# EAGLE design IMU (EAGLE 5.07)
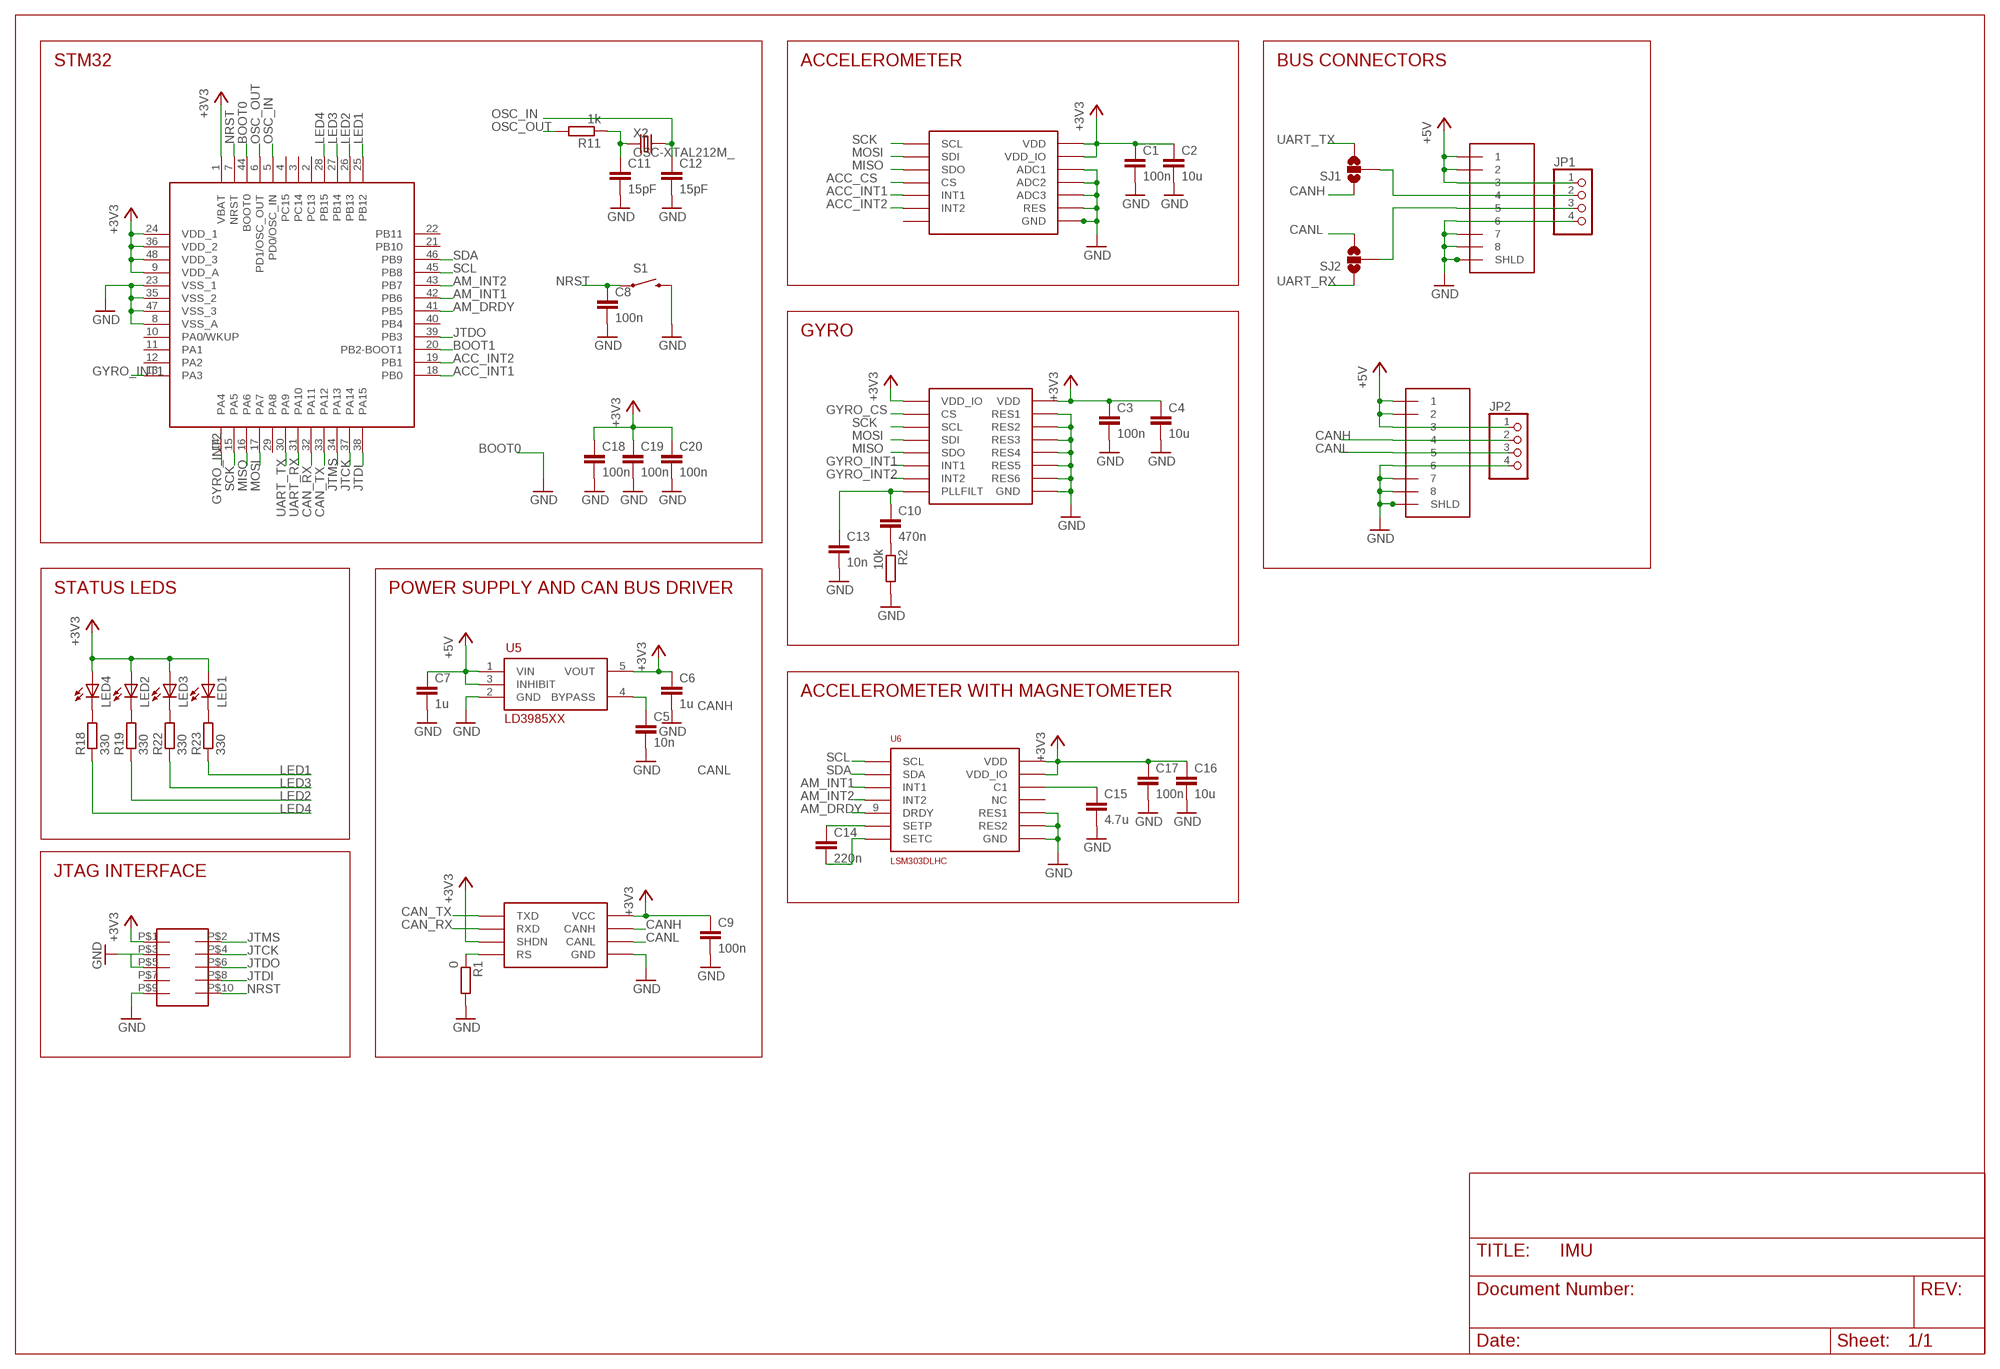
[diagram p0: schematic, sheet 1]

## Parts
1  RJ45-43860  [0438600010]
2  RJ45-43860  [0438600010]
C1  100n  C-EUC0603  [C0603]
C2  10u  C-EUC0805  [C0805]
C3  100n  C-EUC0603  [C0603]
C4  10u  C-EUC0805  [C0805]
C5  10n  C-EUC0603  [C0603]
C6  1u  C-EUC0603  [C0603]
C7  1u  C-EUC0603  [C0603]
C8  100n  C-EUC0603  [C0603]
C9  100n  C-EUC0603  [C0603]
C10  470n  C-EUC0603  [C0603]
C11  15pF  C-EUC0603  [C0603]
C12  15pF  C-EUC0603  [C0603]
C13  10n  C-EUC0603  [C0603]
C14  220n  C-EUC0603  [C0603]
C15  4.7u  C-EUC0805  [C0805]
C16  10u  C-EUC0805  [C0805]
C17  100n  C-EUC0603  [C0603]
C18  100n  C-EUC0603  [C0603]
C19  100n  C-EUC0603  [C0603]
C20  100n  C-EUC0603  [C0603]
JP1  PINHD-1X4/90  [1X04/90]
JP2  PINHD-1X4/90  [1X04/90]
LED1  LEDCHIPLED_0805  [CHIPLED_0805]
LED2  LEDCHIPLED_0805  [CHIPLED_0805]
LED3  LEDCHIPLED_0805  [CHIPLED_0805]
LED4  LEDCHIPLED_0805  [CHIPLED_0805]
R1  0  R-EU_R0603  [R0603]
R2  10k  R-EU_R0603  [R0603]
R11  1k  R-EU_R0603  [R0603]
R18  330  R-EU_R0603  [R0603]
R19  330  R-EU_R0603  [R0603]
R22  330  R-EU_R0603  [R0603]
R23  330  R-EU_R0603  [R0603]
S1  SWITCH-MOMENTARY-2-SMD-1101NE  [TACTILE-SWITCH-1101NE]
SJ1  SOLDERJUMPER_2WAYPASTE1&2  [SJ_3_PASTE1&2]
SJ2  SOLDERJUMPER_2WAYPASTE1&2  [SJ_3_PASTE1&2]
SOT1  MAX3051  [SOT23-8L]
U1  STM32F103CX  [LQFP48]
U2  L3G4200D  [LGA16]
U3  LIS3DH  [LGA16]
U5  LD3985XX  [SOT23-5L]
U6  LSM303DLHC  [LGA14]
U$4  FTSH-105  [FTSH-105]
X2  OSC-XTAL212M_  [4X6]

## Nets
+3V3: C1.1 C2.1 C3.1 C4.1 C6.1 C9.1 C16.1 C17.1 C18.1 C19.1 C20.1 LED1.A LED2.A LED3.A LED4.A SOT1.P$3(VCC) SOT1.P$5(SHDN) U1.1(VBAT) U1.9(VDD_A) U1.24(VDD_1) U1.36(VDD_2) U1.48(VDD_3) U2.P$1(VDD_IO) U2.P$16(VDD) U3.P$1(VDD_IO) U3.P$14(VDD) U5.5(VOUT) U6.1(VDD_IO) U6.14(VDD) U$4.P$1
+5V: 1.P$1 1.P$2 1.P$3 2.P$1 2.P$2 2.P$3 C7.1 JP1.1 JP2.1 U5.1(VIN) U5.3(INHIBIT)
ACC_CS: U3.P$8(CS)
ACC_INT1: U1.18(PB0) U3.P$11(INT1)
ACC_INT2: U1.19(PB1) U3.P$9(INT2)
AM_DRDY: U1.41(PB5) U6.9(DRDY)
AM_INT1: U1.42(PB6) U6.5(INT1)
AM_INT2: U1.43(PB7) U6.4(INT2)
BOOT0: U1.44(BOOT0) ; supply symbol labelled GND
BOOT1: U1.20(PB2-BOOT1)
CAN_RX: SOT1.P$4(RXD) U1.32(PA11)
CAN_TX: SOT1.P$1(TXD) U1.33(PA12)
CANH: 2.P$4 JP2.2 SJ1.1 SOT1.P$7(CANH)
CANL: 2.P$5 JP2.3 SJ2.3 SOT1.P$6(CANL)
GND: 1.P$6 1.P$7 1.P$8 1.P$9(SHLD) 1.P$10 2.P$6 2.P$7 2.P$8 2.P$9(SHLD) 2.P$10 C1.2 C2.2 C3.2 C4.2 C5.2 C6.2 C7.2 C8.2 C9.2 C11.2 C12.2 C13.2 C15.2 C16.2 C17.2 C18.2 C19.2 C20.2 JP1.4 JP2.4 R1.2 R2.2 S1.P$2 SOT1.P$2(GND) U1.8(VSS_A) U1.23(VSS_1) U1.35(VSS_2) U1.47(VSS_3) U2.P$8(RES1) U2.P$9(RES2) U2.P$10(RES3) U2.P$11(RES4) U2.P$12(RES5) U2.P$13(GND) U2.P$15(RES6) U3.P$5(GND) U3.P$10(RES) U3.P$12(GND_2) U3.P$13(ADC3) U3.P$15(ADC2) U3.P$16(ADC1) U5.2(GND) U6.7(GND) U6.10(RES1) U6.11(RES2) U$4.P$3 U$4.P$9
GYRO_CS: U2.P$5(CS)
GYRO_INT1: U1.13(PA3) U2.P$7(INT1)
GYRO_INT2: U1.14(PA4) U2.P$6(INT2)
JTCK: U1.37(PA14) U$4.P$4
JTDI: U1.38(PA15) U$4.P$8
JTDO: U1.39(PB3) U$4.P$6
JTMS: U1.34(PA13) U$4.P$2
LED1: R23.1 U1.25(PB12)
LED2: R19.1 U1.26(PB13)
LED3: R22.1 U1.27(PB14)
LED4: R18.1 U1.28(PB15)
MISO: U1.16(PA6) U2.P$4(SDO) U3.P$7(SDO)
MOSI: U1.17(PA7) U2.P$3(SDI) U3.P$6(SDI)
N$1: U$4.P$5
N$2: R1.1 SOT1.P$8(RS)
N$3: 1.P$4 JP1.2 SJ1.2
N$4: C5.1 U5.4(BYPASS)
N$8: 1.P$5 JP1.3 SJ2.2
N$9: C10.2 R2.1
N$10: C10.1 C13.1 U2.P$14(PLLFILT)
N$12: C11.1 R11.1 X2.1(X1)
N$14: C14.1 U6.12(SETP)
N$15: LED4.C R18.2
N$16: C14.2 U6.13(SETC)
N$17: C15.1 U6.6(C1)
N$18: LED2.C R19.2
N$20: LED3.C R22.2
N$22: LED1.C R23.2
NRST: C8.1 S1.P$1 U1.7(NRST) U$4.P$10
OSC_IN: C12.1 U1.5(PD0/OSC_IN) X2.2(X2)
OSC_OUT: R11.2 U1.6(PD1/OSC_OUT)
SCK: U1.15(PA5) U2.P$2(SCL) U3.P$4(SCL)
SCL: U1.45(PB8) U6.2(SCL)
SDA: U1.46(PB9) U6.3(SDA)
UART_RX: SJ2.1 U1.31(PA10)
UART_TX: SJ1.3 U1.30(PA9)
Unconnected: U1.2(PC13) U1.3(PC14) U1.4(PC15) U1.10(PA0/WKUP) U1.11(PA1) U1.12(PA2) U1.21(PB10) U1.22(PB11) U1.29(PA8) U1.40(PB4) U3.P$2(NC1) U3.P$3(NC2) U6.8(NC) U$4.P$7

## Notes on the sheet
- STM32 | ACCELEROMETER | BUS CONNECTORS
- GYRO
- STATUS LEDS | POWER SUPPLY AND CAN BUS DRIVER
- ACCELEROMETER WITH MAGNETOMETER
- JTAG INTERFACE

## Library data of the parts
1 2 = molex:RJ45-43860
C1-C20 = rcl:C-EU: CAPACITOR, European symbol
JP1 JP2 = pinhead:PINHD-1X4: PIN HEADER
LED1-LED4 = led:LED: LED OSRAM: - CHIPLED LG R971, LG N971, LY N971, LG Q971, LY Q971, LO R971, LY R971 LH N974, LH R974 LS Q976, LO Q976, LY Q976 LO Q996 - Hyper CHIPLED LW Q18S LB Q993, LB Q99A, LB R99A - SideLED LS A670, LO A670, LY A670, LG A670, LP A670 LB A673, LV A673, LT A673, LW A673 LH A674 LY A675 LS A676, LA A676, LO A676, LY A676, LW A676 LS A679, LY A679, LG A679 - Hyper Micro SIDELED® LS Y876, LA Y876, LO Y876, LY Y876 LT Y87S - SmartLED LW L88C, LW L88S LB L89C, LB L89S, LG L890 LS L89K, LO L89K, LY L89K LS L896, LA L896, LO L896, LY L896 - TOPLED LS T670, LO T670, LY T670, LG T670, LP T670 LSG T670, LSP T670, LSY T670, LOP T670, LYG T670 LG T671, LOG T671, LSG T671 LB T673, LV T673, LT T673, LW T673 LH T674 LS T676, LA T676, LO T676, LY T676, LB T676, LH T676, LSB T676, LW T676 LB T67C, LV T67C, LT T67C, LS T67K, LO T67K, LY T67K, LW E67C LS E67B, LA E67B, LO E67B, LY E67B, LB E67C, LV E67C, LT E67C LW T67C LS T679, LY T679, LG T679 LS T770, LO T770, LY T770, LG T770, LP T770 LB T773, LV T773, LT T773, LW T773 LH T774 LS E675, LA E675, LY E675, LS T675 LS T776, LA T776, LO T776, LY T776, LB T776 LHGB T686 LT T68C, LB T68C - Hyper Mini TOPLED® LB M676 - Mini TOPLED Santana® LG M470 LS M47K, LO M47K, LY M47K Source: http://www.osram.convergy.de LUXEON: - LUMILED® LXK2-PW12-R00, LXK2-PW12-S00, LXK2-PW14-U00, LXK2-PW14-V00 LXK2-PM12-R00, LXK2-PM12-S00, LXK2-PM14-U00 LXK2-PE12-Q00, LXK2-PE12-R00, LXK2-PE12-S00, LXK2-PE14-T00, LXK2-PE14-U00 LXK2-PB12-K00, LXK2-PB12-L00, LXK2-PB12-M00, LXK2-PB14-N00, LXK2-PB14-P00, LXK2-PB14-Q00 LXK2-PR12-L00, LXK2-PR12-M00, LXK2-PR14-Q00, LXK2-PR14-R00 LXK2-PD12-Q00, LXK2-PD12-R00, LXK2-PD12-S00 LXK2-PH12-R00, LXK2-PH12-S00 LXK2-PL12-P00, LXK2-PL12-Q00, LXK2-PL12-R00 Source: www.luxeon.com KINGBRIGHT: KA-3528ASYC Source: www.kingbright.com
R1 R2 R11 R18 R19 R22 R23 = rcl:R-EU_: RESISTOR, European symbol
S1 = SparkFun:SWITCH-MOMENTARY-2
SJ1 SJ2 = SparkFun:SOLDERJUMPER_2WAY: Solder Jumper 2 way solder jumper
SOT1 = maxim:MAX3051
U1 = st:STM32F103CX
U2 = st:L3G4200D
U3 = st:LIS3DH
U5 = st:LD3985XX
U6 = st:LSM303DLHC
U$4 = samtec:FTSH-105
X2 = dp_devices:OSC-XTAL2

## Board
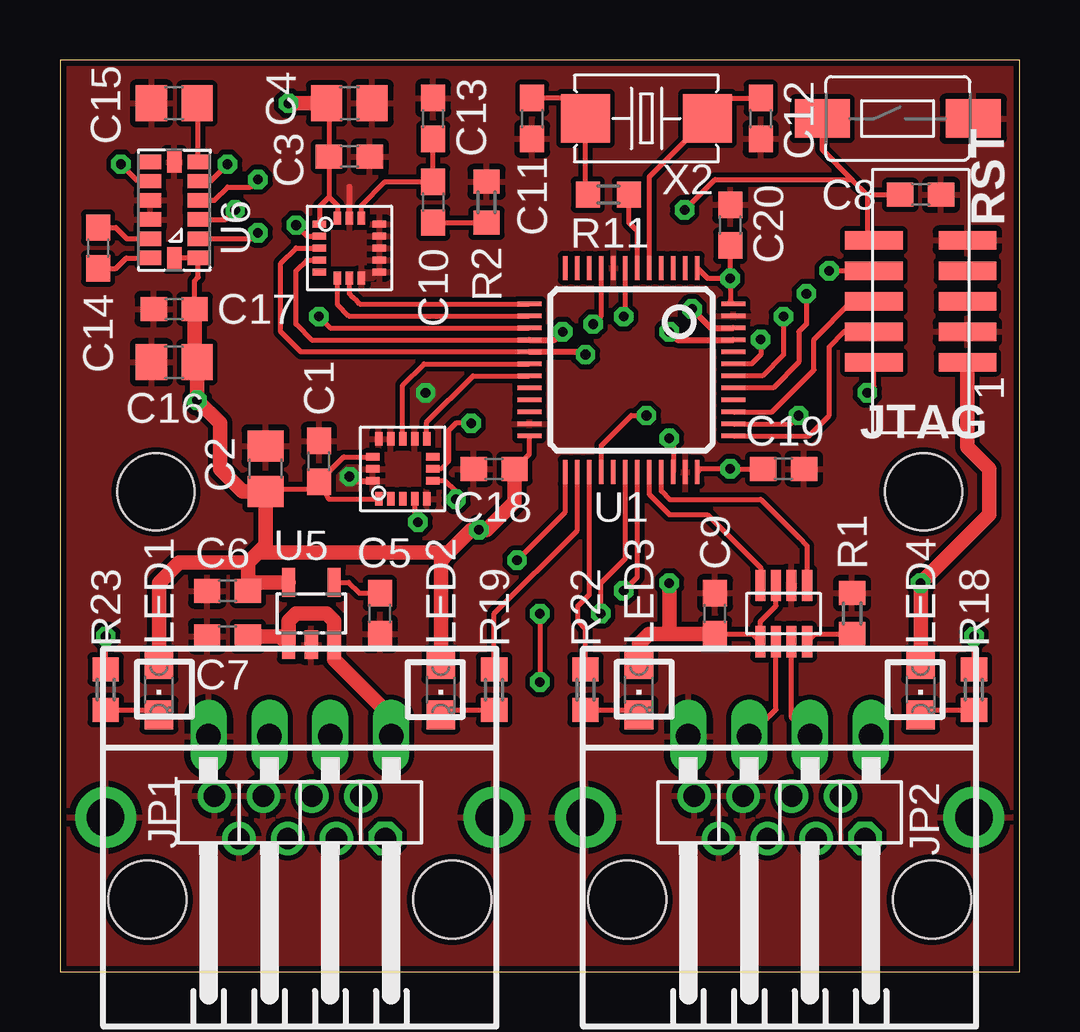
[diagram p1: board, top side]
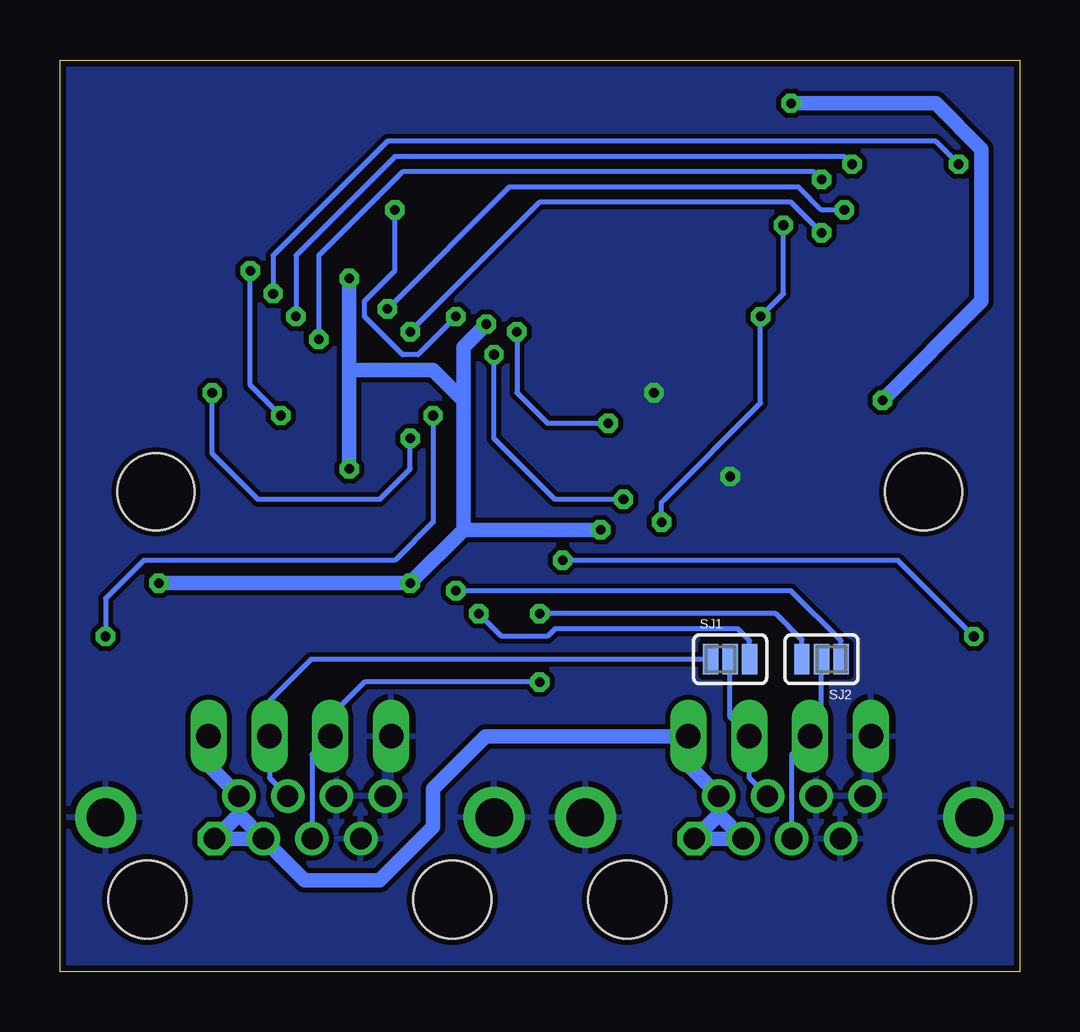
[diagram p2: board, bottom side, seen from below]

Size 40 x 38 mm. Coordinates in mm from the lower left corner, seen from the top.
Outline: 0,0 40,0 40,38 0,38 0,0
Copper layers (1*16): Top 0.035mm / dielectric 1.5mm / Bottom 0.035mm
Design rules "default *": minimum track width 8mil, minimum drill 0.4mm, track to track 8mil, track to pad 8mil, pad to pad 8mil, via to via 8mil, smd to smd 8mil, copper to edge 10mil, drill to drill 8mil, minimum pad ring 10mil, minimum via ring 8mil, stop-mask expansion 4mil, vias tented up to drill 0mil, thermal gap 10mil
Holes 3.2 mm at 4,20 36,20

### Footprints (pad centres in the part's own frame; a part is rotated, then mirrored left to right if it is on the bottom)
0438600010 = drill 0.889 octagon: P$1 3.556,2.54 | drill 0.889 round: P$2 2.54,4.318; P$3 1.524,2.54; P$4 0.508,4.318; P$5 -0.508,2.54; P$6 -1.524,4.318; P$7 -2.54,2.54; P$8 -3.556,4.318 | drill 1.575 pad 2.54 round: P$9 8.103,3.429; P$10 -8.103,3.429 | hole 3.251: -6.35,0; 6.35,0
C0603 = smd 1.1 x 1: 1 -0.85,0; 2 0.85,0
C0805 = smd 1.3 x 1.5: 1 -0.95,0; 2 0.95,0
1X04/90 = drill 1.016 long: 1 -3.81,-3.81; 2 -1.27,-3.81; 3 1.27,-3.81; 4 3.81,-3.81
CHIPLED_0805 = smd 1.2 x 1.2: A 0,-1.05; C 0,1.05
R0603 = smd 1 x 1.1: 1 -0.85,0; 2 0.85,0
TACTILE-SWITCH-1101NE = smd 2.3 x 1.6: P$1 -3.15,0; P$2 3.15,0
SJ_3_PASTE1&2 = smd 0.635 x 1.27: 1 -0.813,0; 2 0,0; 3 0.813,0
SOT23-8L@1 = smd 1.3 x 0.42: P$1 -1.175,1.3; P$2 -1.175,0.65; P$3 -1.175,0; P$4 -1.175,-0.65; P$5 1.175,-0.65; P$6 1.175,0; P$7 1.175,0.65; P$8 1.175,1.3
LQFP48 = smd 1 x 0.2: 1 -4.25,2.75; 2 -4.25,2.25; 3 -4.25,1.75; 4 -4.25,1.25; 5 -4.25,0.75; 6 -4.25,0.25; 7 -4.25,-0.25; 8 -4.25,-0.75; 9 -4.25,-1.25; 10 -4.25,-1.75; 11 -4.25,-2.25; 12 -4.25,-2.75; 25 4.25,-2.75; 26 4.25,-2.25; 27 4.25,-1.75; 28 4.25,-1.25; 29 4.25,-0.75; 30 4.25,-0.25; 31 4.25,0.25; 32 4.25,0.75; 33 4.25,1.25; 34 4.25,1.75; 35 4.25,2.25; 36 4.25,2.75 | smd 0.2 x 1: 13 -2.75,-4.25; 14 -2.25,-4.25; 15 -1.75,-4.25; 16 -1.25,-4.25; 17 -0.75,-4.25; 18 -0.25,-4.25; 19 0.25,-4.25; 20 0.75,-4.25; 21 1.25,-4.25; 22 1.75,-4.25; 23 2.25,-4.25; 24 2.75,-4.25; 37 2.75,4.25; 38 2.25,4.25; 39 1.75,4.25; 40 1.25,4.25; 41 0.75,4.25; 42 0.25,4.25; 43 -0.25,4.25; 44 -0.75,4.25; 45 -1.25,4.25; 46 -1.75,4.25; 47 -2.25,4.25; 48 -2.75,4.25
LGA16 = smd 0.55 x 0.3: P$1 -1.25,1; P$2 -1.25,0.5; P$3 -1.25,0; P$4 -1.25,-0.5; P$5 -1.25,-1; P$9 1.25,-1; P$10 1.25,-0.5; P$11 1.25,0; P$12 1.25,0.5; P$13 1.25,1 | smd 0.3 x 0.55: P$6 -0.5,-1.25; P$7 0,-1.25; P$8 0.5,-1.25; P$14 0.5,1.25; P$15 0,1.25; P$16 -0.5,1.25
SOT23-5L = smd 0.55 x 1.2: 1 -0.95,-1.3; 2 0,-1.3; 3 0.95,-1.3; 4 0.95,1.3; 5 -0.95,1.3
LGA14 = smd 0.6 x 0.9: 1 -2,-1; 2 -1.2,-1; 3 -0.4,-1; 4 0.4,-1; 5 1.2,-1; 6 2,-1; 8 2,1; 9 1.2,1; 10 0.4,1; 11 -0.4,1; 12 -1.2,1; 13 -2,1 | smd 0.9 x 0.6: 7 2,0; 14 -2,0
FTSH-105 = smd 0.76 x 2.4: P$1 -2.54,-1.95; P$2 -2.54,1.95; P$3 -1.27,-1.95; P$4 -1.27,1.95; P$5 0,-1.95; P$6 0,1.95; P$7 1.27,-1.95; P$8 1.27,1.95; P$9 2.54,-1.95; P$10 2.54,1.95
4X6 = smd 2.032 x 2.032: 1 -2.54,0; 2 2.54,0

### Placement (x,y rotation side)
1  10,3 0 top
2  30,3 0 top
C1  10.79,21.27 90 top
C2  8.57,20.95 90 top
C3  12.06,33.97 0 top
C4  12.06,36.2 0 top
C5  13.34,14.92 270 top
C6  6.99,15.88 180 top
C7  6.99,13.97 180 top
C8  35.88,32.38 0 top
C9  27.3,14.92 90 top
C10  15.56,32.07 270 top
C11  19.68,35.56 270 top
C12  29.21,35.56 270 top
C13  15.56,35.56 90 top
C14  1.59,30.16 270 top
C15  4.76,36.2 180 top
C16  4.76,25.4 180 top
C17  4.76,27.62 180 top
C18  18.1,20.95 180 top
C19  30.16,20.95 0 top
C20  27.94,31.11 90 top
JP1  10,6 180 top
JP2  30,6 180 top
LED1  4.13,11.75 180 top
LED2  15.88,11.75 180 top
LED3  24.13,11.75 180 top
LED4  35.88,11.75 180 top
R1  33.02,14.92 90 top
R2  17.78,32.07 90 top
R11  22.86,32.38 0 top
R18  38.1,11.75 270 top
R19  18.1,11.75 270 top
R22  21.91,11.75 270 top
R23  1.91,11.75 270 top
S1  34.92,35.56 0 top
SJ1  12.06,13.02 0 bottom
SJ2  8.26,13.02 180 bottom
SOT1  MAX3051  [SOT23-8L@1]  29.84,14.92 270 top
U1  23.81,25.08 270 top
U2  12.06,30.16 0 top
U3  14.29,20.95 90 top
U5  10.48,14.92 0 top
U6  4.76,31.75 90 top
U$4  35.88,27.94 90 top
X2  24.45,35.56 0 top

### Tracks (layer width: path | path; a pad name or v marks a point on that pad's centre or on a via)
+3V3  (via drill 0.4)
  Top 0.203: 11.21,36.09 C3.1 11.21,32.28 | U2.P$16 11.56,31.93 11.21,32.28 | U2.P$1 10.81,31.88 11.21,32.28 | U3.P$14 11.83,21.45 C1.1 | U3.P$1 11.2,19.7 C1.1 | 28.06,29.82 C20.1 v27.94,28.89 | C16.1 5.61,25.5 | C17.1 5.61,28.79 5.76,28.94 U6.1 U6.14 | C2.1 8.25,20 | 8.99,20.11 10.48,20.11 C1.1 | C19.1 v27.94,20.95 26.68,20.95 U1.36 | U1.24 19.56,21.57 C18.1 | C9.1 28.87,14.07 SOT1.P$5 29.2,14.59 29.84,15.24 SOT1.P$3 | U1.48 27.94,27.95 v27.94,28.89 | U1.1 27,28.89 v27.94,28.89 | LED4.A 35.88,13.97 | U1.9 22.56,27.32 v22.23,26.99
  Top 0.254: C4.1 11.21,36.09 | C2.1 8.99,20.11 | C6.1 7.87,16.22
  Top 0.61: 7.87,16.22 U5.5 | 7.83,17.04 C6.1 | 7.83,17.04 8.26,17.46 | LED1.A 4.13,16.19 4.98,17.04 7.83,17.04 | 5.61,25.5 C17.1 | C16.1 v5.71,23.82 v5.71,23.81 6.67,22.86 6.67,20.95 7.62,20 8.25,20 | 16.19,17.46 17.14,18.41 v17.46,18.41 17.78,18.41 18.95,19.58 C18.1 | 8.26,17.46 16.19,17.46 | LED2.A 15.88,17.14 16.19,17.46 | C2.1 8.57,17.78 8.26,17.46 | v9.53,36.2 C4.1 | 25.4,14.07 24.55,14.07 24.13,13.65 LED3.A | 25.4,14.07 C9.1 | LED4.A v35.88,16.19 38.73,19.05 38.73,20.95 37.83,21.86 U$4.P$1 | v25.4,16.19 25.4,14.07
  Bottom 0.61: v9.53,36.2 3.49,36.2 1.59,34.29 1.59,27.94 v5.71,23.81 | 27.94,25.08 v27.94,20.95 | 27.94,25.08 v27.94,28.89 | v17.46,18.41 23.18,18.41 | 23.18,18.41 v25.4,16.19 v35.88,16.19 | 27.94,25.08 24.45,25.08 23.18,23.81 | 23.18,18.41 23.18,23.81 | v22.23,26.99 23.18,26.04 23.18,23.81
+5V
  Top 0.61: JP1.1 13.81,10.64 11.43,13.02 U5.3 11.43,14.61 11.11,14.92 9.84,14.92 9.53,14.61 U5.1 9.18,13.97 C7.1
  Bottom 0.61: 12.54,6.56 1.P$1 11.57,5.54 | 12.54,6.56 1.P$2 13.81,8.59 JP1.1 22.26,9.81 24.45,7.62 24.45,6.03 26.67,3.81 29.79,3.81 2.P$3 | 12.54,6.56 1.P$3 | 2.P$3 32.54,6.56 | 2.P$3 2.P$1 32.54,6.56 | 32.54,6.56 2.P$2 33.81,8.59 JP2.1
ACC_INT1
  Top 0.203: U1.18 15.17,25.33 14.29,24.45 U3.P$11
ACC_INT2
  Top 0.203: U1.19 17.21,24.83 15.29,22.91 U3.P$9
AM_DRDY  (via drill 0.4)
  Top 0.203: U1.41 29.73,24.33 30.8,25.4 30.8,26.67 31.11,26.99 v31.11,28.26 | U6.9 3.25,32.95 v2.54,33.66
  Bottom 0.203: v2.54,33.66 3.49,34.61 26.35,34.61 31.11,29.84 v31.11,28.26
AM_INT1  (via drill 0.4)
  Top 0.203: U1.42 29.28,24.83 30.16,25.72 v30.16,27.3 | U6.5 6.28,32.95 v6.99,33.66
  Bottom 0.203: v6.99,33.66 7.3,33.97 26.04,33.97 30.16,29.84 v30.16,27.3
AM_INT2  (via drill 0.4)
  Top 0.203: U1.43 28.82,25.33 29.21,25.72 v29.21,26.35 | U6.4 6.43,32.15 6.99,32.7 7.94,32.7 v8.26,33.02
  Bottom 0.203: v8.26,33.02 8.57,33.34 25.72,33.34 29.21,29.84 v29.21,26.35
CAN_RX
  Top 0.203: 29.21,16.11 29.21,16.83 26.99,19.05 25.4,19.05 24.56,19.89 U1.32
  Top 0.254: 29.21,16.11 SOT1.P$4
CAN_TX
  Top 0.203: SOT1.P$1 31.14,17.75 30.8,18.1 30.48,18.41 29.21,19.68 25.4,19.68 25.06,20.02 U1.33
CANH
  Top 0.203: SOT1.P$7 30.5,10.59 JP2.2
  Bottom 0.203: 2.P$4 31.27,8.08 JP2.2 31.27,11.28 29.53,13.02 SJ1.1
CANL  (via drill 0.4)
  Top 0.203: SOT1.P$6 29.84,10.93 JP2.3 | v20,14.92 v20,12.06
  Bottom 0.203: 2.P$5 29.49,9.05 JP2.3 28.73,10.64 27.3,12.06 v20,12.06 | v20,14.92 10.16,14.92 9.07,13.83 SJ2.3
GND  (via drill 0.4)
  Top 0.203: U3.P$5 15.29,19.64
  Top 0.254: U2.P$15 12.06,32.7 | U3.P$16 12.25,20.45 v12.06,20.64
  other vias: 15.24,24.13
  pour Top: 0,0 40,0 40,38 0,38
  pour Bottom: 0,0 40.01,0 40.01,38.1 0,38.1
GYRO_INT1
  Top 0.203: U2.P$7 12.06,28.26 12.22,28.1 12.38,27.94 12.49,27.83 U1.13
GYRO_INT2
  Top 0.203: U1.14 12.04,27.33 11.56,27.8 U2.P$6
JTCK
  Top 0.203: 32.7,26.67 32.07,26.04 32.07,23.18 31.22,22.33 U1.37
  Top 0.254: 32.7,26.67 U$4.P$4
JTDI  (via drill 0.4)
  Top 0.203: U1.38 30.45,22.83 v30.8,23.18 | v32.07,29.21 U$4.P$8
  Bottom 0.203: v30.8,23.18 32.07,24.45 v32.07,29.21
JTDO
  Top 0.203: 33.02,27.94 31.43,26.35 31.43,25.08 29.68,23.33 U1.39
  Top 0.254: 33.02,27.94 U$4.P$6
JTMS  (via drill 0.4)
  Top 0.203: U$4.P$2 33.93,24.4 v33.66,24.13 | U1.34 25.56,22.06 v25.4,22.23
  Bottom 0.203: v25.4,22.23 25.4,20.95 26.67,19.68 31.75,19.68 33.66,21.59 v33.66,24.13
LED1  (via drill 0.4)
  Top 0.203: U1.25 21.06,19.16 v19.05,17.14 | R23.1 v1.91,13.97
  Bottom 0.203: v19.05,17.14 5.08,17.14 v1.91,13.97
LED2
  Top 0.203: U1.26 21.56,18.39 18.1,14.92 R19.1
LED3
  Top 0.203: U1.27 22.06,15.71 21.59,15.24 21.59,14.61 21.91,14.29 R22.1
LED4  (via drill 0.4)
  Top 0.203: U1.28 22.56,21.93 23.81,23.18 v24.45,23.18 | v38.1,13.97 R18.1
  Bottom 0.203: v24.45,23.18 24.45,18.73 26.04,17.14 36.51,17.14 38.1,15.56 v38.1,13.97
MISO  (via drill 0.4)
  Top 0.203: U1.16 10.5,26.33 9.84,26.99 9.84,29.21 10.29,29.66 U2.P$4 | U3.P$7 15.88,20.95 16.19,21.27 16.19,22.54 16.51,22.86 v17.14,22.86
  Top 0.254: U1.16 20.62,26.33 v20.95,26.67
  Bottom 0.203: v17.14,22.86 19.68,22.86 20.95,24.13 v20.95,26.67
MOSI  (via drill 0.4)
  Top 0.203: U2.P$3 9.84,30.16 9.21,29.53 9.21,26.67 10.04,25.83 U1.17 | U3.P$6 16.06,20.45 16.51,20 v16.51,19.68
  Top 0.254: U1.17 21.79,25.83 v21.91,25.72
  Bottom 0.203: v16.51,19.68 19.37,19.68 21.91,22.23 v21.91,25.72
N$2
  Top 0.203: R1.1 31.47,14.07 SOT1.P$8
N$3
  Bottom 0.203: SJ1.2 12.06,10.61 JP1.2 11.27,8.08 1.P$4
N$4
  Top 0.203: C5.1 12.48,15.77 12.04,16.22 U5.4
N$8
  Bottom 0.203: SJ2.2 8.26,10.29 JP1.3 9.49,9.05 1.P$5
N$9
  Top 0.203: C10.2 R2.1
N$10
  Top 0.203: C13.1 C10.1 13.55,32.92 12.56,31.93 U2.P$14
N$12
  Top 0.203: 21.06,36.41 C11.1 | 21.91,32.49 X2.1
  Top 0.254: X2.1 21.06,36.41 | R11.1 21.91,32.49
N$14
  Top 0.203: U6.12 2.79,30.55 2.33,31.01 C14.1
N$15
  Top 0.203: R18.2 36.08,10.9 LED4.C
N$16
  Top 0.203: U6.13 2.76,29.75 2.33,29.31 C14.2
N$17
  Top 0.203: U6.6 5.76,36.15 C15.1
N$18
  Top 0.203: R19.2 16.07,10.9 LED2.C
N$20
  Top 0.203: R22.2 23.93,10.9 LED3.C
N$22
  Top 0.203: R23.2 3.93,10.9 LED1.C
NRST  (via drill 0.4)
  Top 0.203: v26.04,31.75 27.3,33.02 33.02,33.02 | 33.66,32.38 33.66,30.75 U$4.P$10 | 33.66,32.38 C8.1 | S1.P$1 31.77,34.27 33.02,33.02 | 33.02,33.02 33.66,32.38 | U1.7 23.56,27.37 v23.5,27.3
  Bottom 0.203: v23.5,27.3 25.08,25.72 25.72,25.72 27.3,27.3 27.3,27.94 26.04,29.21 v26.04,31.75
OSC_IN
  Top 0.203: 27.84,36.41 C12.1 | U1.5 24.56,33.13 X2.2
  Top 0.254: X2.2 27.84,36.41
OSC_OUT
  Top 0.203: U1.6 24.06,30.86 23.71,31.22 R11.2
SCK  (via drill 0.4)
  Top 0.203: U3.P$4 14.79,18.87 v14.92,18.73 | U2.P$2 10.29,30.66 v9.84,31.11 | U1.15 11.27,26.83 v10.79,27.3
  Bottom 0.203: v9.84,31.11 9.84,28.26 v10.79,27.3 10.79,23.7 U3.P$4 14.92,19.57 v14.92,18.73
SCL  (via drill 0.4)
  Top 0.203: U6.2 8.01,30.55 v8.26,30.8
  Top 0.254: U1.45 25.74,26.33 v25.4,26.67
  Bottom 0.203: v8.26,30.8 9.53,32.07 20,32.07 v25.4,26.67
SDA  (via drill 0.4)
  Top 0.203: U6.3 6.9,31.35 v7.3,31.75
  Top 0.254: U1.46 27.14,26.83 v26.35,27.62
  Bottom 0.203: v7.3,31.75 8.26,31.75 9.21,32.7 21.27,32.7 v26.35,27.62
UART_RX  (via drill 0.4)
  Top 0.203: U1.31 24.06,16.44 v23.5,15.88
  Bottom 0.203: v23.5,15.88 9.53,15.88 7.44,13.79 SJ2.1
UART_TX  (via drill 0.4)
  Top 0.203: U1.30 23.56,17.21 22.54,16.19 v22.54,14.92
  Bottom 0.203: v22.54,14.92 21.59,13.97 19.68,13.97 19.37,14.29 11.75,14.29 11.25,13.79 SJ1.3

### Text on the board
_tsilk: RST | 1 | JTAG
_bsilk: UART | CAN | UART | CAN